# Altium schematic sheet 01_TOP.SchDoc
size A3; DocumentNumber: 1; SheetNumber: 1; SheetTotal: 21
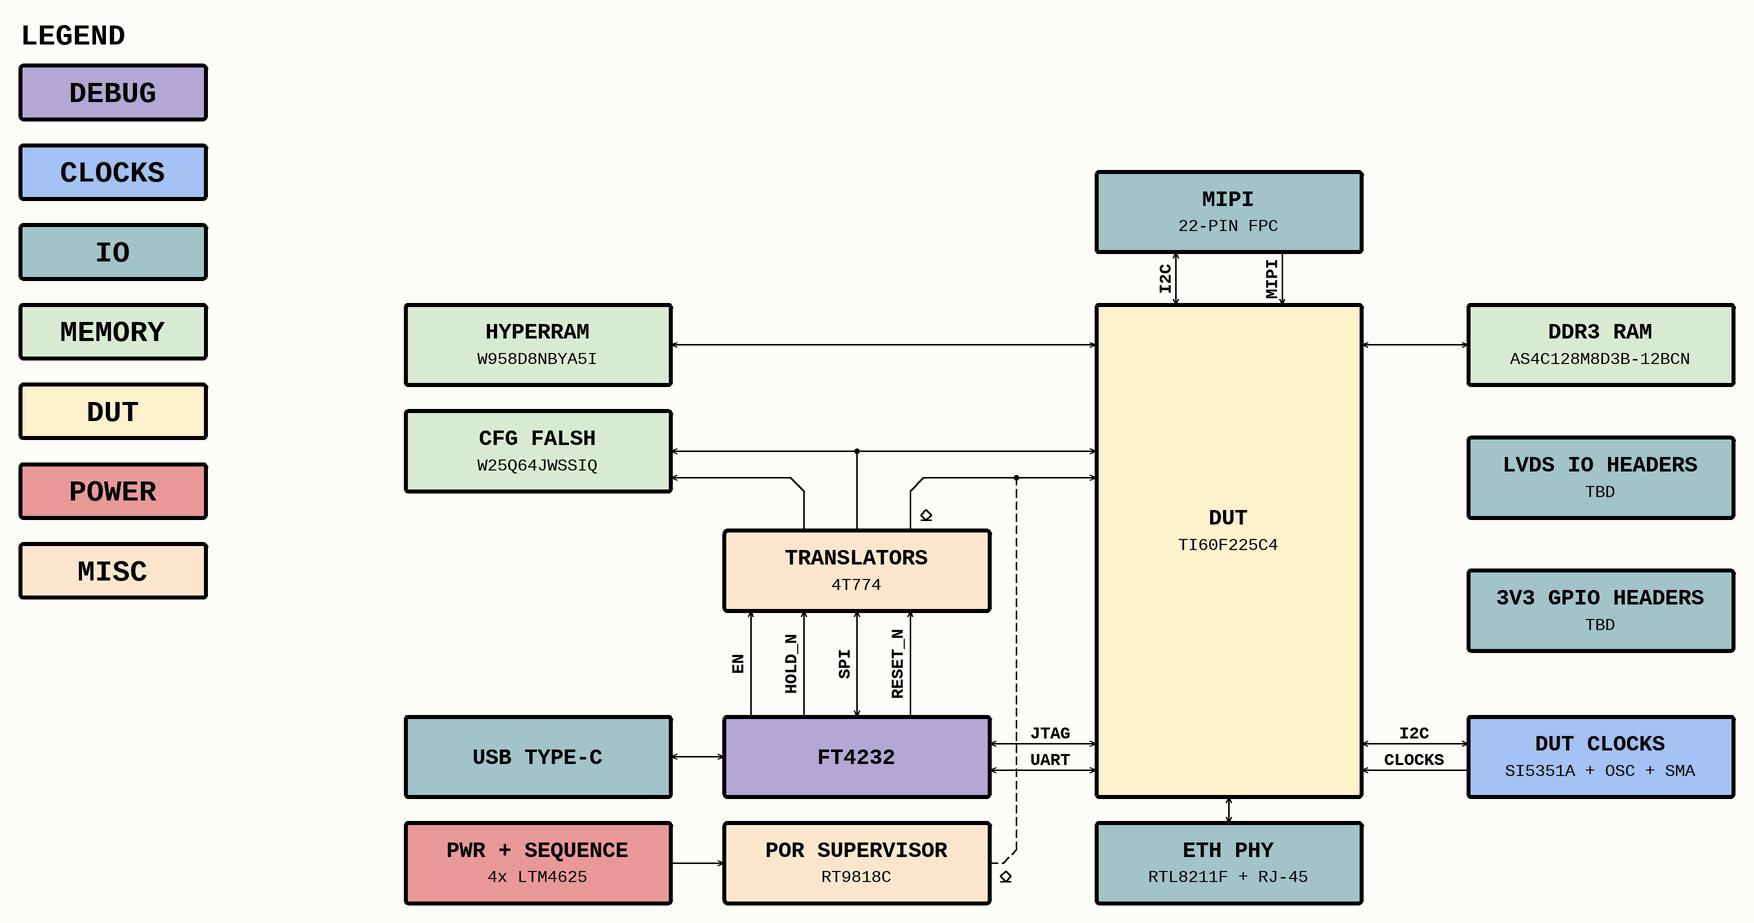
[diagram p0: 01_TOP.SchDoc]

## Notes on the sheet
- LEGEND
- DEBUG
- CLOCKS
- MIPI
- 22-PIN FPC
- IO
- I2C
- MEMORY
- HYPERRAM
- W958D8NBYA5I
- DDR3 RAM
- AS4C128M8D3B-12BCN
- DUT
- CFG FALSH
- POWER
- W25Q64JWSSIQ
- LVDS IO HEADERS
- TBD
- MISC
- TRANSLATORS
- TI60F225C4
- 4T774
- 3V3 GPIO HEADERS
- EN
- HOLD_N
- SPI
- RESET_N
- USB TYPE-C
- FT4232
- JTAG
- UART
- DUT CLOCKS
- SI5351A + OSC + SMA
- PWR + SEQUENCE
- 4x LTM4625
- POR SUPERVISOR
- RT9818C
- ETH PHY
- RTL8211F + RJ-45